# Altium schematic sheet РЕУН.468332.001_Interface.SchDoc: =Name-1str
size 420 x 297 mm; SheetNumber: 4; Вид изделия: Документация; Раздел: Документация; Код документа: Э3; Вид документа: Схема электрическая принципиальная; Класс документа: Конструкторский документ; Создавать изделие в PLM: Yes; DocumentCode: РЕУН.468332.001 Э3 2D; DocumentView: Схема электрическая принципиальная; DocumentClass: Конструкторский документ; ProductView: Документация; Format: А3
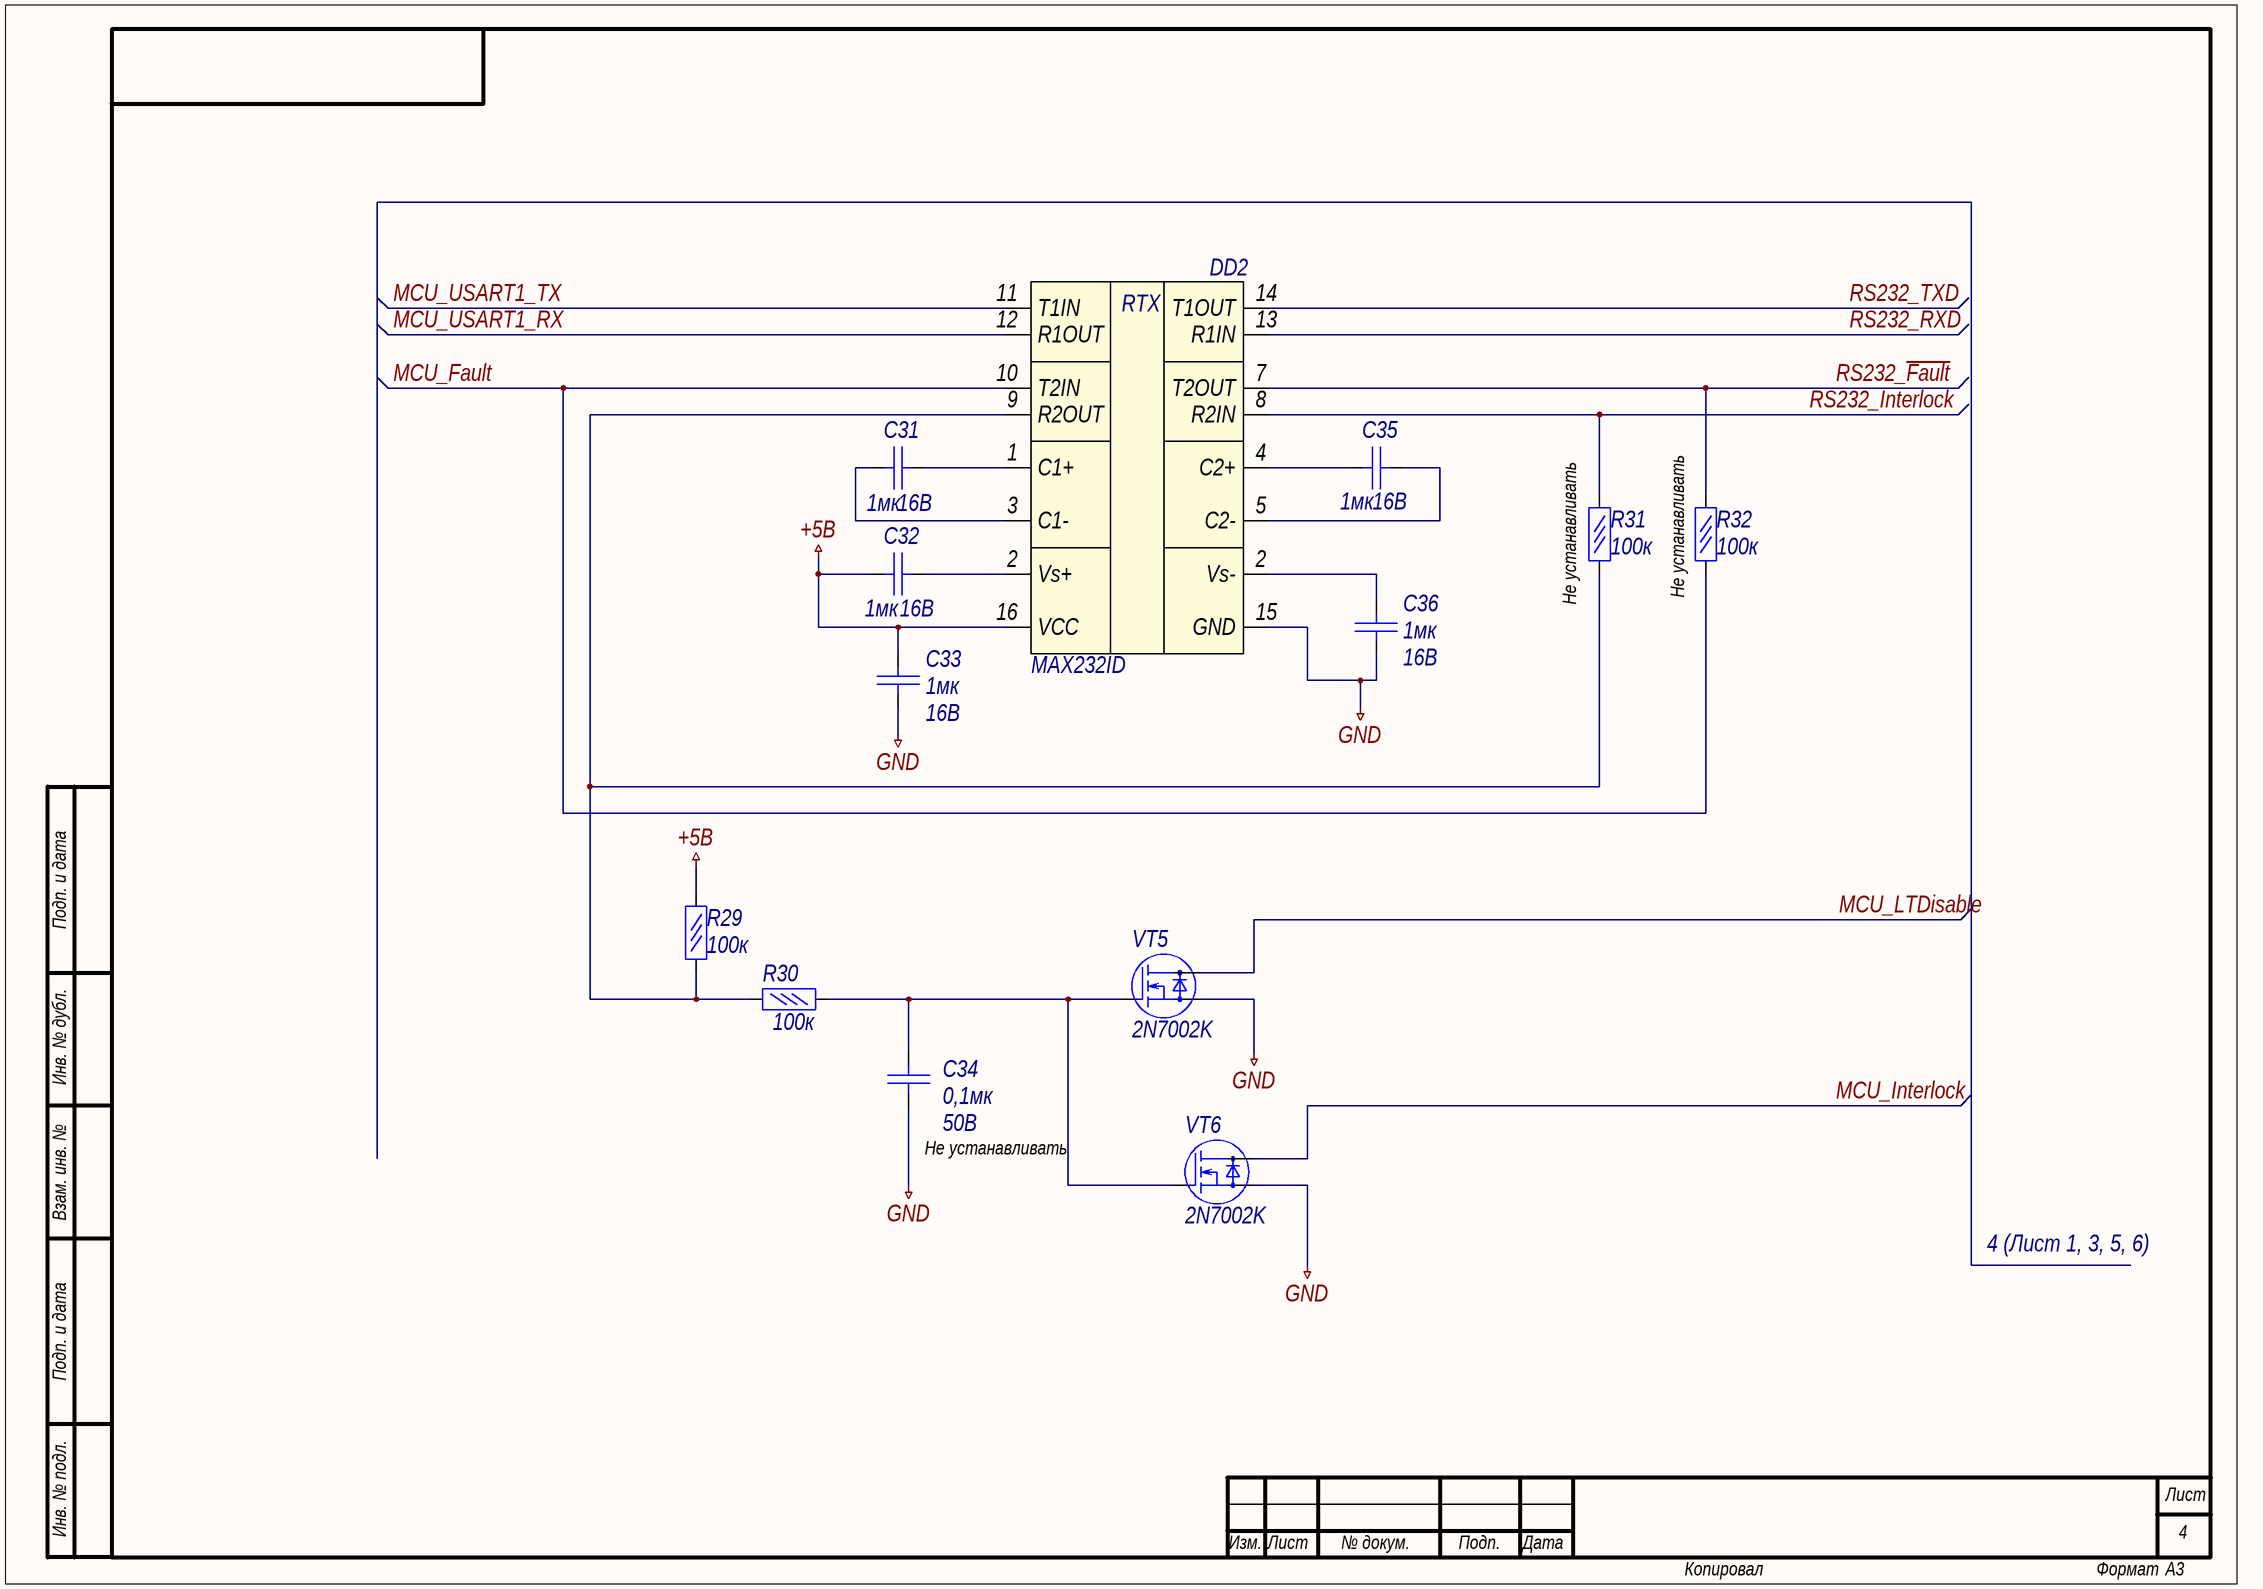
[diagram p0: РЕУН.468332.001_Interface.SchDoc]

## Parts
C31  Voltage: 16В  [C0805_AA]  (hidden comment: 1мк)
C32  Voltage: 16В  [C0805_AA]  (hidden comment: 1мк)
C33  Voltage: 16В  [C0805_AA]  (hidden comment: 1мк)
C34  Voltage: 50В  [C0805_AA]  (hidden comment: 0,1мк)
C35  Voltage: 16В  [C0805_AA]  (hidden comment: 1мк)
C36  Voltage: 16В  [C0805_AA]  (hidden comment: 1мк)
DD2  MAX232ID
R29  100к  [R1206]
R30  100к  [R1206]
R31  100к  [R1206]
R32  100к  [R1206]
VT5  2N7002K  [SOT23-3]
VT6  2N7002K  [SOT23-3]

## Nets
+5В: C32.2 C33.1 DD2.16(VCC) R29.1
GND: C33.2 C34.1 C36.2 DD2.15(GND) VT5.2(S) VT6.2(S)
MCU_Fault: DD2.10(T2IN) R32.2
MCU_Interlock: VT6.3(D)
MCU_LTDisable: VT5.3(D)
MCU_USART1_RX: DD2.12(R1OUT)
MCU_USART1_TX: DD2.11(T1IN)
RS232_~{Fault}: DD2.7(T2OUT) R32.1
RS232_Interlock: DD2.8(R2IN) R31.1
RS232_RXD: DD2.13(R1IN)
RS232_TXD: DD2.14(T1OUT)
NetC31_1: C31.1 DD2.1(C1+)
NetC31_2: C31.2 DD2.3(C1-)
NetC32_1: C32.1 DD2.2(Vs+)
NetC34_2: C34.2 R30.1 VT5.1(G) VT6.1(G)
NetC35_1: C35.1 DD2.5(C2-)
NetC35_2: C35.2 DD2.4(C2+)
NetC36_1: C36.1 DD2.2(Vs-)
NetDD2_9: DD2.9(R2OUT) R29.2 R30.2 R31.2

## Notes on the sheet
- (near R32) Не устанавливать
- (near R31) Не устанавливать
- (near C34) Не устанавливать
- 4 (Лист 1, 3, 5, 6)
- Подп. и дата
- Инв. № дубл.
- Взам. инв. №
- Инв. № подл.
- Лист
- Изм.
- № докум.
- Подп.
- Дата
- Копировал
- Формат
- (in symbol MAX232ID) RTX

## Library data of the parts
C31-C33 C35 C36 = Конденсатор кер.: Name: CC0603KRX7R7BB105; Value: 1мк
C34 = Конденсатор кер.: Name: CC0603KRX7R9BB104; Value: 0,1мк
DD2 = MAX232ID: Dual EIA-232 Drivers/Receivers
R29-R32 = Резистор  0,05Вт: Резистор 0,05Вт; Name: RC0603FR-0710KL; Power rating: 0,05Вт; Value: 100к
VT5 VT6 = mosfet-n: Name: 2N7002K